# EasyEDA Pro project ProPrj_SlimeVR_RelicSkin（fork from SK）.epro, schematic Relic_BNO085
Board Name: Relic_BNO085; Create Date: 2025-10-18; Page Name: BNO085; Project Name: SlimeVR（fork from SK）; Schematic Name: Relic_BNO085; Update Date: 2025-10-18; Company: Designed by SoraKage; Page Size: A4; Version: V2.3
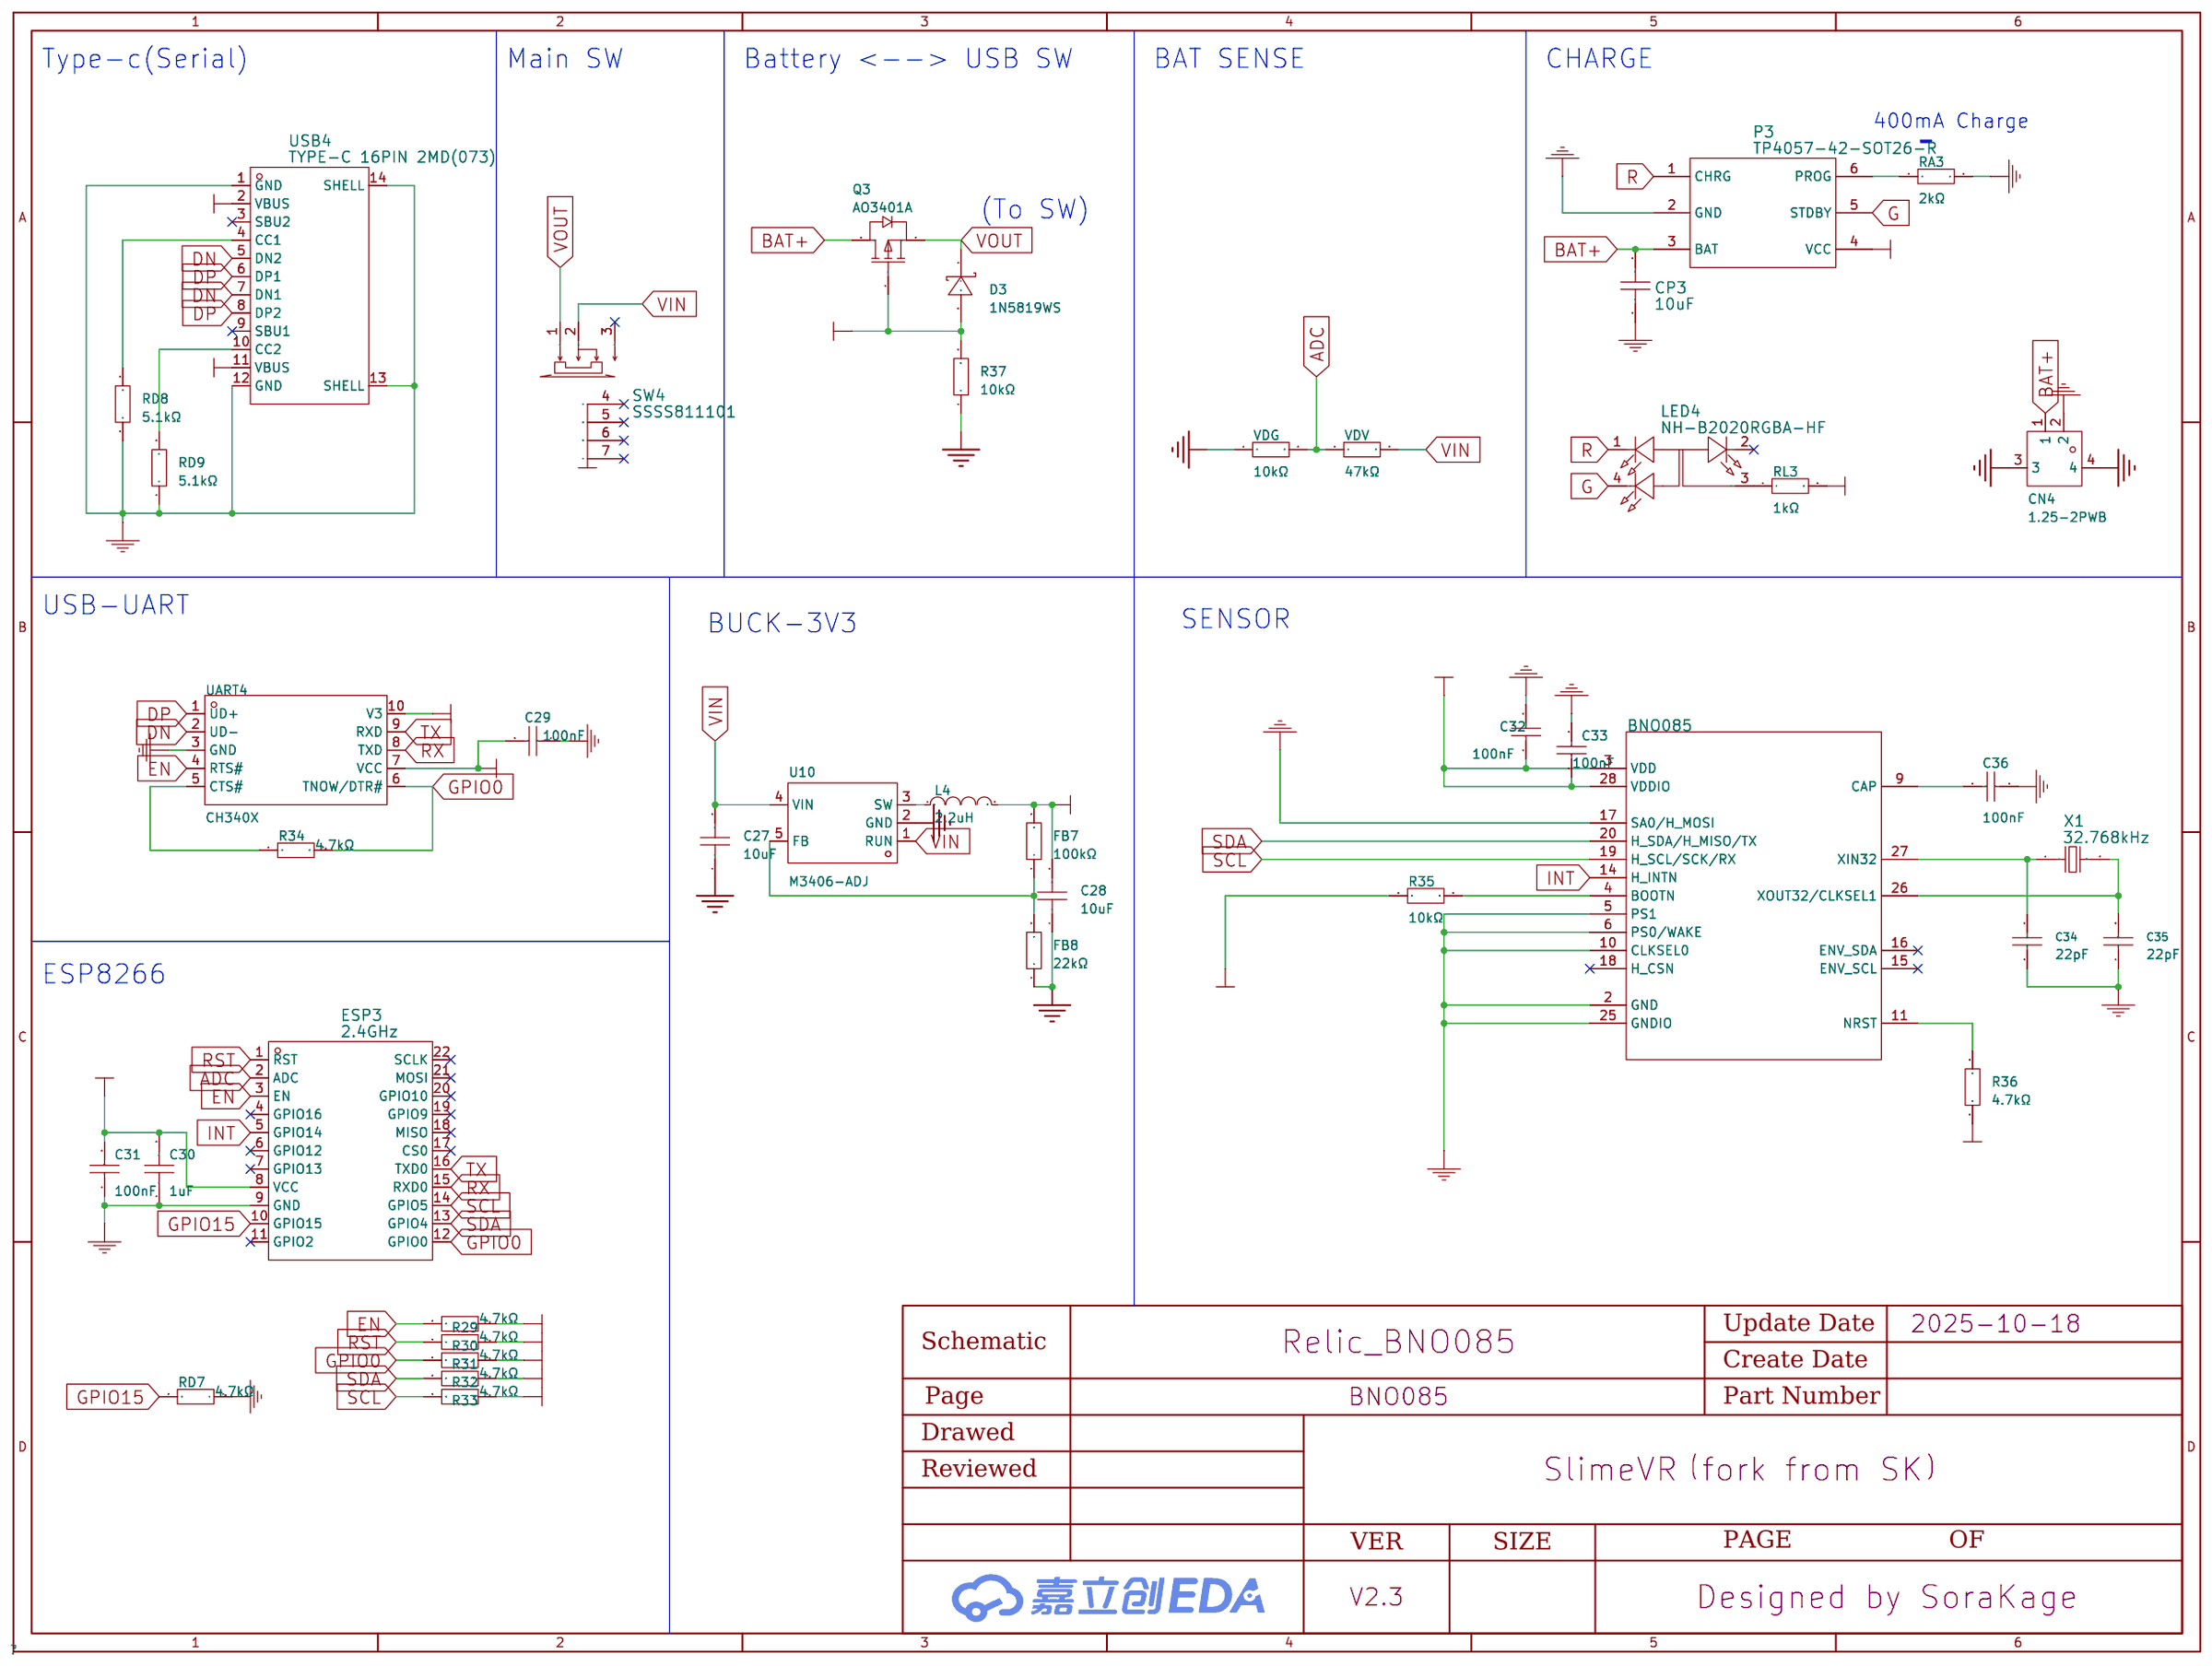
[diagram p2: schematic sheet]

## Parts
BNO085  BNO080  [BNO080]
C27  10uF  [C0603]
C28  10uF  [C0603]
C29  100nF  [C0402]
C30  1uF  [C0402]
C31  100nF  [C0402]
C32  100nF  [C0402]
C33  100nF  [C0402]
C34  22pF  [C0402]
C35  22pF  [C0402]
C36  100nF  [C0402]
CN4  1.25-2PWB  [CONN-SMD_2P-P1.25_DEALON_1.25-2PWB]
CP3  10uF  [C0603]
D3  1N5819WS  [SOD-323_L1.8-W1.3-LS2.5-RD]
ESP3  2.4GHz  [WIFIM-SMD_ESP-12F-ESP8266MOD]
FB7  100kΩ  [R0402]
FB8  22kΩ  [R0402]
L4  2.2uH  [IND-SMD_L2.5-W2.0_YXMBL252010P]
LED4  NH-B2020RGBA-HF  [LED-ARRAY-SMD_4P-L2.1-W2.1-TL_NH-B2020RGBA]
P3  TP4057-42-SOT26-R  [SOT-23-6_L2.9-W1.6-P0.95-LS2.8-BL]
Q3  AO3401A  [SOT-23_L2.9-W1.3-P1.90-LS2.4-BR]
R29  4.7kΩ  [R0402]
R30  4.7kΩ  [R0402]
R31  4.7kΩ  [R0402]
R32  4.7kΩ  [R0402]
R33  4.7kΩ  [R0402]
R34  4.7kΩ  [R0402]
R35  10kΩ  [R0402]
R36  4.7kΩ  [R0402]
R37  10kΩ  [R0402]
RA3  2kΩ  [R0402]
RD7  4.7kΩ  [R0402]
RD8  5.1kΩ  [R0402]
RD9  5.1kΩ  [R0402]
RL3  1kΩ  [R0402]
SW4  SSSS811101  [SW-SMD_SSSS811101]
U10  M3406-ADJ  [SOT-23-5_L3.0-W1.7-P0.95-LS2.8-BR]
UART4  CH340X  [MSOP-10_L3.0-W3.0-P0.50-LS5.0-BL]
USB4  TYPE-C 16PIN 2MD(073)  [USB-C-SMD_TYPE-C-6PIN-2MD-073]
VDG  10kΩ  [R0402]
VDV  47kΩ  [R0402]
X1  32.768kHz  [FC-135R_L3.2-W1.5]

## Library data of the parts
BNO085 = Hillcrest: Supplier: LCSC; Supplier Part: C5189642
C27 C28 = CL10A106KP8NNNC: 容值:10uF;精度:±10%;额定电压:10V;材质(温度系数):X5R;; LCSC Part Name: 10uF ±10% 10V; Supplier Part: C19702; Manufacturer: SAMSUNG(三星); Supplier Footprint: 0603; JLCPCB Part Class: 基础库; Datasheet: https://atta.szlcsc.com/upload/public/pdf/source/20160103/1457707703378.pdf; Supplier: LCSC; Tolerance: ±10%; Voltage Rated: 10V; Temperature Coefficient: X5R
C29 C31-C33 C36 = CL05B104KO5NNNC: 容值:100nF;精度:±10%;额定电压:16V;材质(温度系数):X7R;; LCSC Part Name: 100nF ±10% 16V; Supplier Part: C1525; Manufacturer: SAMSUNG(三星); Supplier Footprint: 0402; JLCPCB Part Class: Basic Part; Datasheet: https://atta.szlcsc.com/upload/public/pdf/source/20160103/1457707674891.pdf; Supplier: LCSC; Tolerance: ±10%; Voltage Rated: 16V; Temperature Coefficient: X7R
C30 = CL05A105KA5NQNC: 容值:1uF;精度:±10%;额定电压:25V;材质(温度系数):X5R;; LCSC Part Name: 1uF ±10% 25V; Supplier Part: C52923; Manufacturer: SAMSUNG(三星); Supplier Footprint: 0402; JLCPCB Part Class: 基础库; Datasheet: https://atta.szlcsc.com/upload/public/pdf/source/20160103/1457707735223.pdf; Supplier: LCSC; Tolerance: ±10%; Voltage Rated: 25V; Temperature Coefficient: X5R
C34 C35 = 0402CG220J500NT: 容值:22pF;精度:±5%;额定电压:50V;材质(温度系数):C0G;; LCSC Part Name: 22pF ±5% 50V; Supplier Part: C1555; Manufacturer: FH(风华); Supplier Footprint: 0402; JLCPCB Part Class: 基础库; Datasheet: https://atta.szlcsc.com/upload/public/pdf/source/20200305/C486355_26A10D38EF8C2A5C37091D0039909270.pdf; Supplier: LCSC; Tolerance: ±5%; Voltage Rated: 50V; Temperature Coefficient: C0G
CN4 = 1.25-2PWB: 插针结构:1x2P;间距:1.25mm;安装方式:卧贴;参考系列:-;总PIN数:2P;排数:1;每排PIN数:2;行距:-;额定电流:-;工作温度范围:-40℃~+85℃;; LCSC Part Name: 1x2P 间距:1.25mm 卧贴; Supplier Part: C2905009; Manufacturer: DEALON(德艺隆); Supplier Footprint: SMD,P=1.25mm,卧贴; JLCPCB Part Class: 扩展库; Datasheet: https://atta.szlcsc.com/upload/public/pdf/source/20231123/1AE0876AE9C7DCFC0D68EAC4CBA881B0.pdf; Supplier: LCSC; Pins Structure: 1x2P; Pitch: 1.25mm; Mounting Style: 卧贴; Number of Pins: 2P; Number of Rows: 1; Number of PINs Per Row: 2; Operating Temperature Range: -40℃~+85℃
CP3 = 10uF: link: https://item.szlcsc.com/362304.html; 3DModel: C0603_L1.6-W0.8-H0.8; Supplier: LCSC; Manufacturer: SAMSUNG(三星); Manufacturer Part: CL10A106KP8NNNC; Supplier Part: C19702; JLCPCB Part Class: Basic Part
D3 = 1N5819WS_C191023: 直流反向耐压(Vr):40V;平均整流电流(Io):1A;正向压降(Vf):600mV@1A;; LCSC Part Name: 40V 1A 600mV@1A; Supplier Part: C191023; Manufacturer: Hottech(合科泰); Supplier Footprint: SOD-323; JLCPCB Part Class: 基础库; Datasheet: https://atta.szlcsc.com/upload/public/pdf/source/20220428/3CB86FD8D28D653594B4E35F9D5AEFD9.pdf; Supplier: LCSC; Reverse Voltage (Vr): 40V; Average Rectified Current (Io): 1A; Forward Voltage (Vf@If): 600mV@1A
ESP3 = ESP-12F(ESP8266MOD): 频率:2.4GHz;发射功率:16dBm;核心处理器:ESP8266;天线形式:PCB 板载天线;接收灵敏度:-90dBm;; LCSC Part Name: 完整的802.11b/g/n Wi-Fi的SoC模块; Supplier Part: C82891; Manufacturer: Ai-Thinker(安信可); Supplier Footprint: SMD,16x24mm; JLCPCB Part Class: Extended Part; Datasheet: https://atta.szlcsc.com/upload/public/pdf/source/20210219/C82891_ABD84A460F4F056A2757267CCCA4B508.pdf; Supplier: LCSC; Output Power: 16dBm; Core Processor: ESP8266; Support Interface: GPIO；UART；I2C；PWM；SPI；ADC; Antenna Type: PCB 板载天线; Wireless Standard: 802.11b/g/n; Operating Voltage: 3.3V; Receive  Current: 120mA; Send  Current: 170mA; Sensitivity: -90dBm; Operating Temperature: -40℃~+85℃
FB7 = 0402WGF1003TCE: 电阻类型:厚膜电阻;阻值:100kΩ;精度:±1%;功率:62.5mW;; LCSC Part Name: 100kΩ ±1% 62.5mW; Supplier Part: C25741; Manufacturer: UNI-ROYAL(厚声); Supplier Footprint: 0402; JLCPCB Part Class: 基础库; Datasheet: https://atta.szlcsc.com/upload/public/pdf/source/20200306/C422600_1E6D84923E4A46A82E41ADD87F860B5C.pdf; Supplier: LCSC; Type: 厚膜电阻; Tolerance: ±1%; Power(Watts): 62.5mW; Temperature Coefficient: ±100ppm/℃; Overload Voltage (Max): 50V; Operating Temperature Range: -55℃~+155℃
FB8 = 0402WGF2202TCE: 电阻类型:厚膜电阻;阻值:22kΩ;精度:±1%;功率:62.5mW;; LCSC Part Name: 22kΩ ±1% 62.5mW; Supplier Part: C25768; Manufacturer: UNI-ROYAL(厚声); Supplier Footprint: 0402; JLCPCB Part Class: 基础库; Datasheet: https://atta.szlcsc.com/upload/public/pdf/source/20200306/C422600_1E6D84923E4A46A82E41ADD87F860B5C.pdf; Supplier: LCSC; Type: 厚膜电阻; Tolerance: ±1%; Power(Watts): 62.5mW; Temperature Coefficient: ±100ppm/℃; Overload Voltage (Max): 50V; Operating Temperature Range: -55℃~+155℃
L4 = APH252010T2R2M: 类型:一体成型电感;电感值:2.2uH;精度:±20%;额定电流:2.1A;饱和电流(Isat):3A;; LCSC Part Name: 2.2uH ±20% 3A; Supplier Part: C5349606; Manufacturer: APV(爱普微); Supplier Footprint: L252010; JLCPCB Part Class: 扩展库; Datasheet: https://atta.szlcsc.com/upload/public/pdf/source/20230112/CD71A991BF44148C80048C09E1A9BC6B.pdf; Supplier: LCSC; Type: 一体成型电感; Tolerance: ±20%; Rated Current: 2.1A; Saturation Current (Isat): 3A; DC Resistance (DCR): 70mΩ
LED4 = NH-B2020RGBA-HF: link: https://atta.szlcsc.com/upload/public/pdf/source/20210810/F2CC95523506BC87574AF0308E7F77A3.pdf; Supplier: LCSC; Supplier Part: C2874116; Manufacturer: 国星光电; JLCPCB Part Class: Extended Part
P3 = TP4057-42-SOT26-R: LCSC Part Name: TP4057 1%; Supplier Part: C12044; Manufacturer: TOPPOWER(南京拓微); Supplier Footprint: SOT-23-6; JLCPCB Part Class: Basic Part; Datasheet: https://atta.szlcsc.com/upload/public/pdf/source/20140228/1457706997013.pdf; Supplier: LCSC
Q3 = AO3401A_C15127: 类型:P沟道;漏源电压(Vdss):30V;连续漏极电流(Id):4A;功率(Pd):1.4W;导通电阻(RDS(on)@Vgs,Id):44mΩ@10V,4.3A;; LCSC Part Name: P沟道 30V 4A; Supplier Part: C15127; Manufacturer: AOS; Supplier Footprint: SOT-23-3L; JLCPCB Part Class: 基础库; Datasheet: https://atta.szlcsc.com/upload/public/pdf/source/20160507/1462613609053.pdf; Supplier: LCSC; Type: P沟道; Drain Source Voltage (Vdss): 30V; Continuous Drain Current (Id): 4A; Power Dissipation (Pd): 1.4W; Drain Source On Resistance (RDS(on)@Vgs,Id): 44mΩ@10V,4.3A; Gate Threshold Voltage (Vgs(th)@Id): 1.3V@250uA
R29-R34 R36 RD7 = 0402WGF4701TCE: 电阻类型:厚膜电阻;阻值:4.7kΩ;精度:±1%;功率:62.5mW;; LCSC Part Name: 4.7kΩ ±1% 62.5mW; Supplier Part: C25900; Manufacturer: UNI-ROYAL(厚声); Supplier Footprint: 0402; JLCPCB Part Class: 基础库; Datasheet: https://atta.szlcsc.com/upload/public/pdf/source/20200306/C422600_1E6D84923E4A46A82E41ADD87F860B5C.pdf; Supplier: LCSC; Type: 厚膜电阻; Tolerance: ±1%; Power(Watts): 62.5mW; Temperature Coefficient: ±100ppm/℃; Overload Voltage (Max): 50V; Operating Temperature Range: -55℃~+155℃
R35 R37 VDG = 0402WGF1002TCE: 电阻类型:厚膜电阻;阻值:10kΩ;精度:±1%;功率:62.5mW;; LCSC Part Name: 10kΩ ±1% 62.5mW; Supplier Part: C25744; Manufacturer: UNI-ROYAL(厚声); Supplier Footprint: 0402; JLCPCB Part Class: 基础库; Datasheet: https://atta.szlcsc.com/upload/public/pdf/source/20200306/C422600_1E6D84923E4A46A82E41ADD87F860B5C.pdf; Supplier: LCSC; Type: 厚膜电阻; Tolerance: ±1%; Power(Watts): 62.5mW; Temperature Coefficient: ±100ppm/℃; Overload Voltage (Max): 50V; Operating Temperature Range: -55℃~+155℃
RA3 = 0402WGF2001TCE: 电阻类型:厚膜电阻;阻值:2kΩ;精度:±1%;功率:62.5mW;; LCSC Part Name: 2kΩ ±1% 62.5mW; Supplier Part: C4109; Manufacturer: UNI-ROYAL(厚声); Supplier Footprint: 0402; JLCPCB Part Class: 基础库; Datasheet: https://atta.szlcsc.com/upload/public/pdf/source/20200306/C422600_1E6D84923E4A46A82E41ADD87F860B5C.pdf; Supplier: LCSC; Type: 厚膜电阻; Tolerance: ±1%; Power(Watts): 62.5mW; Temperature Coefficient: ±100ppm/℃; Overload Voltage (Max): 50V; Operating Temperature Range: -55℃~+155℃
RD8 RD9 = 0402WGF5101TCE: 电阻类型:厚膜电阻;阻值:5.1kΩ;精度:±1%;功率:62.5mW;; LCSC Part Name: 5.1kΩ ±1% 62.5mW; Supplier Part: C25905; Manufacturer: UNI-ROYAL(厚声); Supplier Footprint: 0402; JLCPCB Part Class: 基础库; Datasheet: https://atta.szlcsc.com/upload/public/pdf/source/20200306/C422600_1E6D84923E4A46A82E41ADD87F860B5C.pdf; Supplier: LCSC; Type: 厚膜电阻; Tolerance: ±1%; Power(Watts): 62.5mW; Temperature Coefficient: ±100ppm/℃; Overload Voltage (Max): 50V; Operating Temperature Range: -55℃~+155℃
RL3 = 0402WGF1001TCE: 电阻类型:厚膜电阻;阻值:1kΩ;精度:±1%;功率:62.5mW;; LCSC Part Name: 1kΩ ±1% 62.5mW; Supplier Part: C11702; Manufacturer: UNI-ROYAL(厚声); Supplier Footprint: 0402; JLCPCB Part Class: 基础库; Datasheet: https://atta.szlcsc.com/upload/public/pdf/source/20200306/C422600_1E6D84923E4A46A82E41ADD87F860B5C.pdf; Supplier: LCSC; Type: 厚膜电阻; Tolerance: ±1%; Power(Watts): 62.5mW; Temperature Coefficient: ±100ppm/℃; Overload Voltage (Max): 50V; Operating Temperature Range: -55℃~+155℃
SW4 = SSSS811101: link: https://item.szlcsc.com/110556.html; 3DModel: SW-TH_SSSS811101; Supplier: LCSC; Manufacturer: ALPSALPINE(阿尔卑斯阿尔派); Supplier Part: C109335; JLCPCB Part Class: Extended Part
U10 = M3406-ADJ: 功能类型:降压型;同步整流:-;输出通道数:-;拓扑结构:-;输入电压:-;输出电流(最大值):-;开关频率:-;; LCSC Part Name: 降压型; Supplier Part: C83224; Manufacturer: 西安航天民芯; Supplier Footprint: SOT-23-5; JLCPCB Part Class: 扩展库; Datasheet: https://atta.szlcsc.com/upload/public/pdf/source/20161110/1478742836232.pdf; Supplier: LCSC; Function: 降压型
UART4 = CH340X: Supplier Part: C3035748; Manufacturer: WCH(南京沁恒); Supplier Footprint: MSOP-10; JLCPCB Part Class: Extended Part; Supplier: LCSC
USB4 = TYPE-C 16PIN 2MD(073): link: https://atta.szlcsc.com/upload/public/pdf/source/20210409/C2765186_34D42616F62DF94D17C4D63D74D9FD03.pdf; Supplier: LCSC; Supplier Part: C2765186; Manufacturer: SHOU HAN(首韩); JLCPCB Part Class: Extended Part
VDV = 0402WGF4702TCE: 电阻类型:厚膜电阻;阻值:47kΩ;精度:±1%;功率:62.5mW;; LCSC Part Name: 47kΩ ±1% 62.5mW; Supplier Part: C25792; Manufacturer: UNI-ROYAL(厚声); Supplier Footprint: 0402; JLCPCB Part Class: Basic Part; Datasheet: https://atta.szlcsc.com/upload/public/pdf/source/20200306/C422600_1E6D84923E4A46A82E41ADD87F860B5C.pdf; Supplier: LCSC; Type: 厚膜电阻; Tolerance: ±1%; Power(Watts): 62.5mW; Temperature Coefficient: ±100ppm/℃; Overload Voltage (Max): 50V; Operating Temperature Range: -55℃~+155℃
X1 = Q13FC1350000400: 频率:32.768kHz;频率公差:±20ppm;负载电容:12.5pF;; LCSC Part Name: 32.768kHz ±20ppm 12.5pF; Supplier Part: C32346; Manufacturer: EPSON(爱普生); Supplier Footprint: SMD3215-2P; JLCPCB Part Class: Basic Part; Datasheet: https://atta.szlcsc.com/upload/public/pdf/source/20190108/C32346_746D6B07EAF90824457A96480007685F.pdf; Supplier: LCSC; Crystal Type: 贴片无源晶振; Frequency Tolerance: ±20ppm; Load Capacitance: 12.5pF; Equivalent Series Resistance (ESR): 70kΩ; Operating Temperature: -40℃~+85℃

## Nets
3V3: BNO085.3(VDD) BNO085.28(VDDIO) C28.2 C29.2 C30.2 C31.2 C32.2 C33.2 ESP3.8(VCC) FB7.2 L4.2 R29.1 R30.1 R31.1 R32.1 R33.1 R35.1 R36.2 UART4.7(VCC) UART4.10(V3)
+5V: D3.2(A) P3.4(VCC) Q3.1(G) R37.2 RL3.2 USB4.2(VBUS) USB4.11(VBUS)
GND: BNO085.2(GND) BNO085.5(PS1) BNO085.6(PS0/WAKE) BNO085.10(CLKSEL0) BNO085.17(SA0/H_MOSI) BNO085.25(GNDIO) C27.1 C28.1 C29.1 C30.1 C31.1 C32.1 C33.1 C34.1 C35.1 C36.2 CN4.2 CN4.3 CN4.4 CP3.1 ESP3.9(GND) FB8.1 P3.2(GND) R37.1 RA3.2 RD7.1 RD8.1 RD9.1 U10.2(GND) UART4.3(GND) USB4.1(GND) USB4.12(GND) USB4.13(SHELL) USB4.14(SHELL) VDG.1
VIN: C27.2 SW4.2 U10.1(RUN) U10.4(VIN) VDV.2
ADC: ESP3.2(ADC) VDG.2 VDV.1
BAT+: CN4.1 CP3.2 P3.3(BAT) Q3.3(D)
DN: UART4.2(UD-) USB4.5(DN2) USB4.7(DN1)
DP: UART4.1(UD+) USB4.6(DP1) USB4.8(DP2)
EN: ESP3.3(EN) R29.2 UART4.4(RTS#)
G: LED4.4(-) P3.5(STDBY)
GPIO0: ESP3.12(GPIO0) R31.2 R34.1 UART4.6(TNOW/DTR#)
GPIO15: ESP3.10(GPIO15) RD7.2
INT: BNO085.14(H_INTN) ESP3.5(GPIO14)
R: LED4.1(-) P3.1(CHRG)
RST: ESP3.1(RST) R30.2
RX: ESP3.15(RXD0) UART4.8(TXD)
SCL: BNO085.19(H_SCL/SCK/RX) ESP3.14(GPIO5) R33.2
SDA: BNO085.20(H_SDA/H_MISO/TX) ESP3.13(GPIO4) R32.2
TX: ESP3.16(TXD0) UART4.9(RXD)
VOUT: D3.1(K) Q3.2(S) SW4.1
Net-(BNO085-4): BNO085.4(BOOTN) R35.2
Net-(BNO085-9): BNO085.9(CAP) C36.1
Net-(BNO085-11): BNO085.11(NRST) R36.1
Net-(BNO085-26): BNO085.26(XOUT32/CLKSEL1) C35.2 X1.2
Net-(BNO085-27): BNO085.27(XIN32) C34.2 X1.1
Net-(FB7-1): FB7.1 FB8.2 U10.5(FB)
Net-(L4-1): L4.1 U10.3(SW)
Net-(LED4-3): LED4.3(+) RL3.1
Net-(P3-6): P3.6(PROG) RA3.1
Net-(R34-2): R34.2 UART4.5(CTS#)
Net-(RD8-2): RD8.2 USB4.4(CC1)
Net-(RD9-2): RD9.2 USB4.10(CC2)

Not connected (* = marked no-connect by the designer): BNO085 15(ENV_SCL)* 16(ENV_SDA)* 18(H_CSN)*; ESP3 4(GPIO16)* 6(GPIO12)* 7(GPIO13)* 11(GPIO2)* 17(CS0)* 18(MISO)* 19(GPIO9)* 20(GPIO10)* 21(MOSI)* 22(SCLK)*; LED4 2(-)*; SW4 3* 4* 5* 6* 7*; USB4 3(SBU2)* 9(SBU1)*

## Notes on the sheet
- Type-c(Serial)
- Main SW
- Battery <--> USB SW
- BAT SENSE
- CHARGE
- 400mA Charge
- -
- (To SW)
- USB-UART
- BUCK-3V3
- SENSOR
- ESP8266
